# Altium schematic sheet gydrodrive_button.SchDoc
size 297 x 209 mm; SheetNumber: 6; SheetTotal: 22
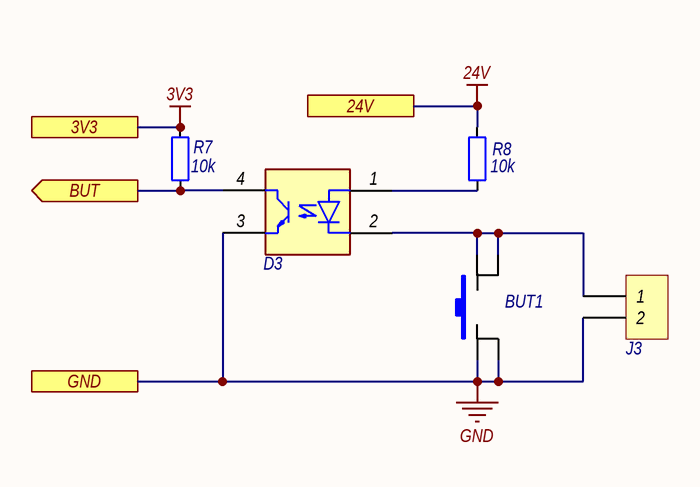
[diagram p0: gydrodrive_button.SchDoc]

## Parts
BUT1  KLS7-TS6604-4.3-180  [SWITCH_6x6_SMD]  (value not drawn)
D3  LTV-817S  [DIP-4-SMD]  (value not drawn)
J3  DG142V-5.08-02P  [DG142V-5.08-02P]  (value not drawn)
R7  Resistance: 10k  [RESC2012-0805M]  (hidden comment: RES_0805)
R8  Resistance: 10k  [RESC2012-0805M]  (hidden comment: RES_0805)

## Ports
3V3 (see gydrodrive_main[4B], gydrodrive_can[3B], gydrodrive_debugger[3B], gydrodrive_encoder[1A], gydrodrive_indication[3C], gydrodrive_inputTrim[2B], gydrodrive_interfaces[3C], gydrodrive_mcu[4C], gydrodrive_rs485[4B], gydrodrive_sto[2B], gydrodrive_supply[5B]), 24V (see gydrodrive_main[4B], gydrodrive_control[4B], gydrodrive_currentSource[2B], gydrodrive_discreteControl[4B], gydrodrive_encoder[3B], gydrodrive_linearPosSensor[3B], gydrodrive_sensor[3B], gydrodrive_sensors[2B], gydrodrive_sto[3B], gydrodrive_supply[2B]), BUT (out, see gydrodrive_main[3B]), GND (see gydrodrive_main[4B], gydrodrive_can[3C], gydrodrive_control[3B], gydrodrive_currentSource[2B], gydrodrive_debugger[4C], gydrodrive_discreteControl[3B], gydrodrive_encoder[1B], gydrodrive_i2c[5C], gydrodrive_indication[3C], gydrodrive_inputTrim[2C], gydrodrive_interfaces[3A], gydrodrive_linearPosSensor[2C], gydrodrive_mcu[6D], gydrodrive_reservedPins[2C], gydrodrive_rs485[3B], gydrodrive_sensor[3C], gydrodrive_sensors[2B], gydrodrive_sto[2C], gydrodrive_supply[2C], gydrodrive_uart[4C])

## Nets
3V3: R7.2 ; port 3V3
24V: R8.2 ; port 24V
GND: BUT1.3 BUT1.4 D3.3(C) J3.2 ; port GND
BUT: D3.4(A) R7.1 ; port BUT
NetBUT1_1: BUT1.1 BUT1.2 D3.2(E) J3.1
NetD3_1: D3.1(K) R8.1

## Notes on the sheet
- Подп. и дата
- Инв. № дубл.
- Взам. инв. №
- Инв. № подл.
- Изм.
- Лист
- № докум.
- Подп.
- Дата
- Копировал
- Формат
- A4

## Library data of the parts
BUT1 = KLS7-TS6604-4.3-180: Тактовая кнопка SMD; Part Name: Тактовая кнопка KLS7-TS6604-4.3-180; Parameters: 4.3мм; Max Price: 20; Part Number: KLS7-TS6604-4.3-180; Component Type: Standart
D3 = LTV-817S: Оптопара транзисторная одноканальная; Part Name: Оптопара транзисторная LTV-817S; Max Price: 50; Part Number: LTV-817S; Component Type: Standart
J3 = DG142V-5.08-02P: Клеммник 2-контактный, шаг 5.08 мм; Part Name: Клеммник DG142V-5.08-02P; Parameters: 8А; Max Price: 60; System: Connector; Part Number: DG142V-5.08-02P; Component Type: Standart; Pin Count: 2
R7 R8 = RESC_0805: Рез-р, корпус 0805; Tolerance: 5%; Parameters: 10k, 5%; Max Price: 3; Part Number: RESC_0805; Part Name: ='Рез-р 0805, ' + Parameters; Component Type: Standart